# Altium schematic sheet ICM-42688-PC1_ICM-42688-PC.schdoc
size 124 x 101 mm
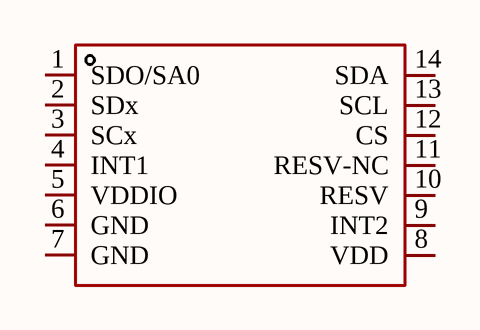
[diagram p0: ICM-42688-PC1_ICM-42688-PC.schdoc]

## Parts
U?  ICM-42688-PC  [LGA-14_L3.0-W2.5-P0.50-TL]  (value not drawn)

## Nets

Not connected (* = marked no-connect by the designer): U? 1(SDO/SA0) 2(SDx) 3(SCx) 4(INT1) 5(VDDIO) 6(GND) 7(GND) 8(VDD) 9(INT2) 10(RESV) 11(RESV-NC) 12(CS) 13(SCL) 14(SDA)

## Library data of the parts
U? = ICM-42688-PC: Manufacturer: Tokmas(托克马斯); Add into BOM: yes; Accelerometer Sensing Axis: X,Y,Z; Acceleration Measurement Range (MAX): ±16g; Gyroscope Measurement Range (MAX): ±2048dps; Sensor Type: IMU; Output Bits: 16bit; Interface: I3C；I2C；SPI; Voltage - Supply: 1.71V~3.6V; Cache Size: 1.5KB; Symbol: ICM-42688-PC; Device: ICM-42688-PC; LCSC Part Name: 低噪声、宽带宽6D惯性测量单元，带运动协处理器; Supplier Part: C48586483; Manufacturer Part: ICM-42688-PC; Supplier Footprint: LGA-14(2.5x3); JLCPCB Part Class: Extended Part; Datasheet: https://item.szlcsc.com/datasheet/ICM-42688-PC/50854565.html; Supplier: LCSC; Convert to PCB: yes; Gyroscope Sensing Axis: X,Y,Z; Operating Temperature: -40℃~+85℃